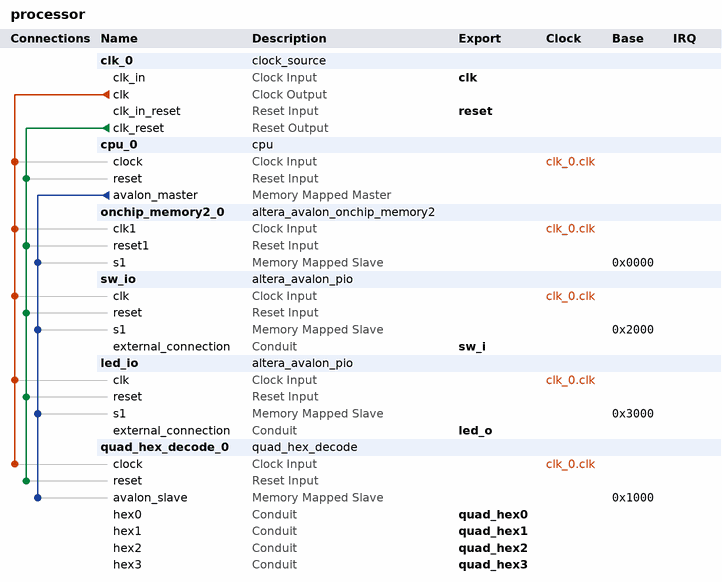
[diagram p0: system contents]
# Platform Designer (Qsys) system processor, Cyclone V 5CSEMA5F31C6
# Parameters at their usual value, and those the tool derives, are not listed.
package require -exact qsys 18.1
create_system processor
set_project_property DEVICE_FAMILY {Cyclone V}
set_project_property DEVICE 5CSEMA5F31C6

add_instance clk_0 clock_source 18.1
set_instance_parameter_value clk_0 clockFrequency 50000000

add_instance cpu_0 cpu 1.0

add_instance onchip_memory2_0 altera_avalon_onchip_memory2 18.1
set_instance_parameter_value onchip_memory2_0 dataWidth 16
set_instance_parameter_value onchip_memory2_0 dualPort false
set_instance_parameter_value onchip_memory2_0 initMemContent true
set_instance_parameter_value onchip_memory2_0 initializationFileName onchip_mem.mif
set_instance_parameter_value onchip_memory2_0 memorySize 4096
set_instance_parameter_value onchip_memory2_0 useNonDefaultInitFile true

add_instance sw_io altera_avalon_pio 18.1
set_instance_parameter_value sw_io direction Input
set_instance_parameter_value sw_io width 10

add_instance led_io altera_avalon_pio 18.1
set_instance_parameter_value led_io direction Output
set_instance_parameter_value led_io width 10

add_instance quad_hex_decode_0 quad_hex_decode 1.0

# connections
add_connection clk_0.clk cpu_0.clock clock
add_connection clk_0.clk led_io.clk clock
add_connection clk_0.clk onchip_memory2_0.clk1 clock
add_connection clk_0.clk quad_hex_decode_0.clock clock
add_connection clk_0.clk sw_io.clk clock
add_connection clk_0.clk_reset cpu_0.reset reset
add_connection clk_0.clk_reset led_io.reset reset
add_connection clk_0.clk_reset onchip_memory2_0.reset1 reset
add_connection clk_0.clk_reset quad_hex_decode_0.reset reset
add_connection clk_0.clk_reset sw_io.reset reset
add_connection cpu_0.avalon_master led_io.s1 avalon
set_connection_parameter_value cpu_0.avalon_master/led_io.s1 baseAddress 0x3000
add_connection cpu_0.avalon_master onchip_memory2_0.s1 avalon
set_connection_parameter_value cpu_0.avalon_master/onchip_memory2_0.s1 baseAddress 0x0000
add_connection cpu_0.avalon_master quad_hex_decode_0.avalon_slave avalon
set_connection_parameter_value cpu_0.avalon_master/quad_hex_decode_0.avalon_slave baseAddress 0x1000
add_connection cpu_0.avalon_master sw_io.s1 avalon
set_connection_parameter_value cpu_0.avalon_master/sw_io.s1 baseAddress 0x2000

# exported interfaces
add_interface clk clock sink
set_interface_property clk EXPORT_OF clk_0.clk_in
add_interface led_o conduit end
set_interface_property led_o EXPORT_OF led_io.external_connection
add_interface quad_hex0 conduit end
set_interface_property quad_hex0 EXPORT_OF quad_hex_decode_0.hex0
add_interface quad_hex1 conduit end
set_interface_property quad_hex1 EXPORT_OF quad_hex_decode_0.hex1
add_interface quad_hex2 conduit end
set_interface_property quad_hex2 EXPORT_OF quad_hex_decode_0.hex2
add_interface quad_hex3 conduit end
set_interface_property quad_hex3 EXPORT_OF quad_hex_decode_0.hex3
add_interface reset reset sink
set_interface_property reset EXPORT_OF clk_0.clk_in_reset
add_interface sw_i conduit end
set_interface_property sw_i EXPORT_OF sw_io.external_connection

set_interconnect_requirement {$system} qsys_mm.clockCrossingAdapter HANDSHAKE
set_interconnect_requirement {$system} qsys_mm.enableEccProtection FALSE
set_interconnect_requirement {$system} qsys_mm.insertDefaultSlave FALSE
set_interconnect_requirement {$system} qsys_mm.maxAdditionalLatency 1

save_system processor.qsys
